# EAGLE schematic SHKaFF (EAGLE 7.0.0)
Силовой шкаф ТЗ от 15.07.14
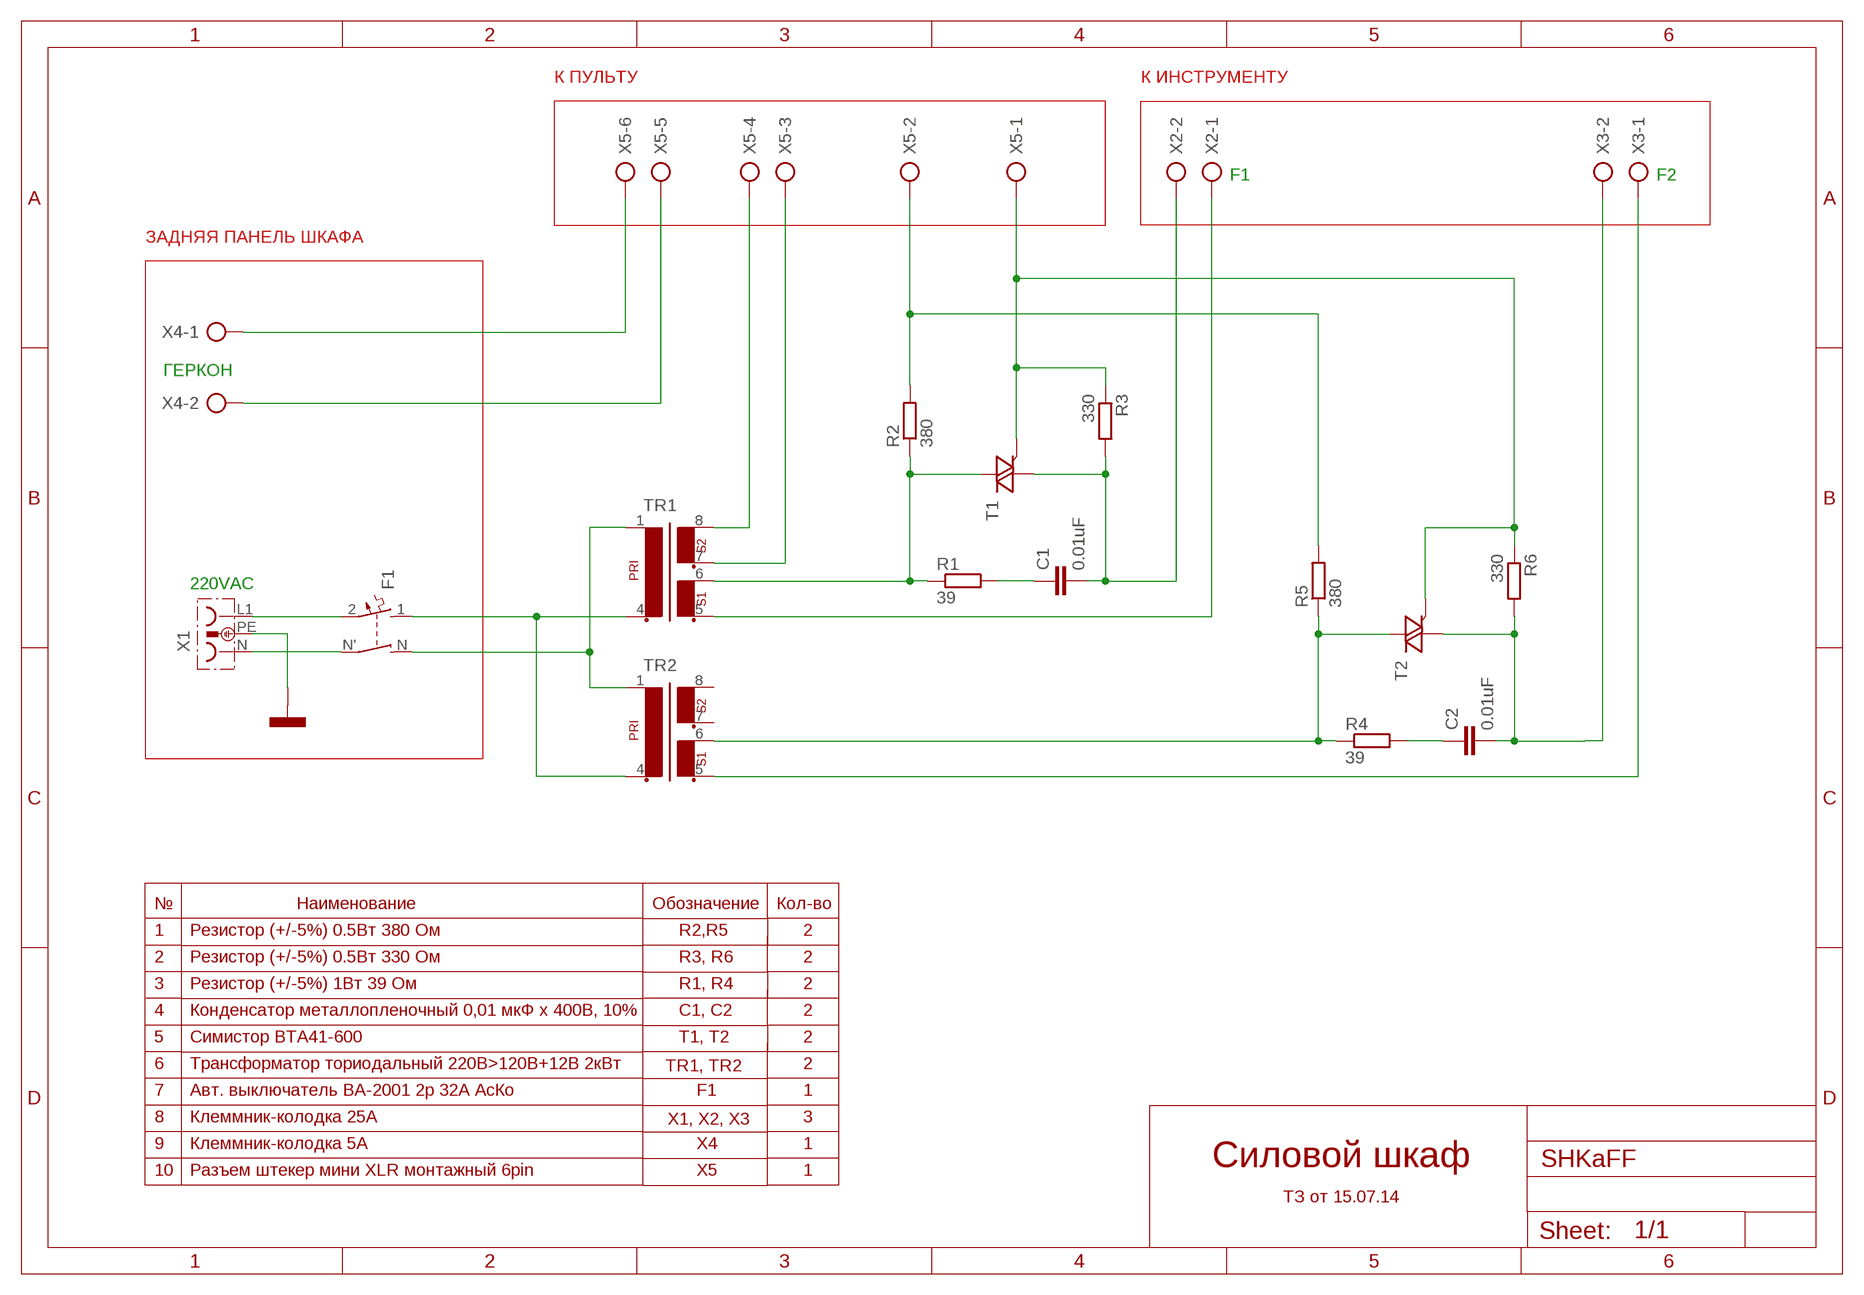
[diagram p0: schematic, sheet 1]

## Parts
C1  0.01uF  C-EU025-030X050  [C025-030X050]
C2  0.01uF  C-EU025-030X050  [C025-030X050]
F1  LEITUNGSSCHUTZSCHALTER_2-POL  [LEITUNGSSCHUTZSCHALTER_2-POL]
R1  39  R-EU_0207/5V  [0207/5V]
R2  380  R-EU_0207/5V  [0207/5V]
R3  330  R-EU_0207/5V  [0207/5V]
R4  39  R-EU_0207/5V  [0207/5V]
R5  380  R-EU_0207/5V  [0207/5V]
R6  330  R-EU_0207/5V  [0207/5V]
T1  BTA26-V  [TOP3S-1]
T2  BTA26-V  [TOP3S-1]
TR1  EE20-2  [EE20-2]
TR2  EE20-2  [EE20-2]
X1  STECKDOSE  [STECKDOSE]
X2  AK500/2  [AK500/2]
X3  AK500/2  [AK500/2]
X4  AK500/2  [AK500/2]
X5  AK500/6  [AK500/6]
X6  MASSE_ALLGEMEIN  [MASSE_ALLGEMEIN]

## Nets
GR1: X4.1 X5.6
GR2: X4.2 X5.5
L12V: TR1.8 X5.4
MOC4: R3.1 R6.1 T1.G T2.G X5.1
MOC6: R2.2 R5.2 X5.2
N12V: TR1.7 X5.3
N$1: F1.2 X1.L1
N$2: F1.N'(N) X1.N
N$3: F1.1 TR1.4 TR2.4
N$4: F1.N TR1.1 TR2.1
N$5: TR1.5 X2.1
N$6: TR2.5 X3.1
N$7: R1.1 R2.1 T1.A2 TR1.6
N$8: C1.2 R3.2 T1.A1 X2.2
N$9: C1.1 R1.2
N$10: R4.1 R5.1 T2.A2 TR2.6
N$11: C2.2 R6.2 T2.A1
N$12: C2.1 R4.2
N$13: X3.2
N$14: X1.PE X6.1(0V)
Unconnected: TR2.7 TR2.8

## Notes on the sheet
- К ПУЛЬТУ | К ИНСТРУМЕНТУ
- F1 | F2
- ЗАДНЯЯ ПАНЕЛЬ ШКАФА
- ГЕРКОН
- 220VAC
- № | Наименование | Обозначение | Кол-во
- 1 | Резистор (+/-5%) 0.5Вт 380 Ом | R2,R5 | 2
- 2 | Резистор (+/-5%) 0.5Вт 330 Ом | R3, R6 | 2
- 3 | Резистор (+/-5%) 1Вт 39 Ом | R1, R4 | 2
- 4 | Конденсатор металлопленочный 0,01 мкФ х 400В, 10% | C1, C2 | 2
- 5 | Симистор BTA41-600 | T1, T2 | 2
- 6 | Трансформатор ториодальный 220В>120В+12В 2кВт | TR1, TR2 | 2
- 7 | Авт. выключатель ВА-2001 2р 32А АсКо | F1 | 1
- 8 | Клеммник-колодка 25A | X1, X2, X3 | 3
- 9 | Клеммник-колодка 5A | X4 | 1
- Силовой шкаф
- 10 | Разъем штекер мини XLR монтажный 6pin | X5 | 1
- ТЗ от 15.07.14

## Library data of the parts
C1 C2 = rcl:C-EU: CAPACITOR, European symbol
F1 = e-sicherungen:LEITUNGSSCHUTZSCHALTER_2-POL: Leitungsschutzschalter, 2-pol.
R1-R6 = rcl:R-EU_: RESISTOR, European symbol
T1 T2 = triac:BTA26: 25A TRIAC Source: http://www.st.com/stonline/products/literature/ds/7470.pdf
TR1 TR2 = trafo:EE20-2: TRANSFORMER 1 primary winding, 2 secondary windings ERA
X1 = e-steckverbinder:STECKDOSE: Steckdose mit Schutzleiter
X2-X4 = con-ptr500:AK500/2: CONNECTOR; OC_FARNELL: unknown; OC_NEWARK: unknown
X5 = con-ptr500:AK500/6: CONNECTOR; OC_FARNELL: unknown; OC_NEWARK: unknown
X6 = e-klemmen:MASSE_ALLGEMEIN: Masse allgemein